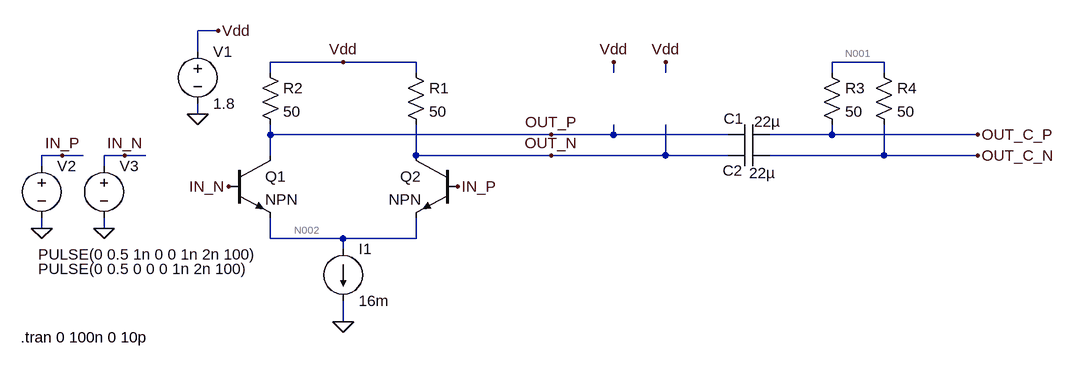
[diagram p0: schematic Draft1.asc]
Draft1.asc, the LTspice schematic file:
Version 4
SHEET 1 1184 680
WIRE -112 -32 -144 -32
WIRE -144 0 -144 -32
WIRE 80 16 -32 16
WIRE 192 16 80 16
WIRE 912 16 832 16
WIRE -32 32 -32 16
WIRE 192 32 192 16
WIRE 496 32 496 16
WIRE 576 32 576 16
WIRE 832 32 832 16
WIRE 912 32 912 16
WIRE -144 96 -144 80
WIRE -32 128 -32 112
WIRE 400 128 -32 128
WIRE 496 128 496 112
WIRE 496 128 400 128
WIRE 672 128 496 128
WIRE 832 128 832 112
WIRE 832 128 736 128
WIRE 1056 128 832 128
WIRE -352 160 -384 160
WIRE -320 160 -352 160
WIRE -256 160 -288 160
WIRE -224 160 -256 160
WIRE -32 160 -32 128
WIRE 192 160 192 112
WIRE 400 160 192 160
WIRE 576 160 576 112
WIRE 576 160 400 160
WIRE 672 160 576 160
WIRE 912 160 912 112
WIRE 912 160 736 160
WIRE 1056 160 912 160
WIRE -384 176 -384 160
WIRE -288 176 -288 160
WIRE -384 272 -384 256
WIRE -288 272 -288 256
WIRE -32 288 -32 256
WIRE 80 288 -32 288
WIRE 192 288 192 256
WIRE 192 288 80 288
WIRE 80 304 80 288
WIRE 80 416 80 384
FLAG 80 416 0
FLAG -144 96 0
FLAG -384 272 0
FLAG -288 272 0
FLAG -352 160 IN_P
FLAG -256 160 IN_N
FLAG -96 208 IN_N
FLAG 256 208 IN_P
FLAG 400 128 OUT_P
FLAG 400 160 OUT_N
FLAG -112 -32 Vdd
FLAG 80 16 Vdd
FLAG 496 16 Vdd
FLAG 576 16 Vdd
FLAG 1056 128 OUT_C_P
FLAG 1056 160 OUT_C_N
SYMBOL current 80 304 R0
WINDOW 123 0 0 Left 0
WINDOW 39 0 0 Left 0
SYMATTR InstName I1
SYMATTR Value 16m
SYMBOL res 176 16 R0
SYMATTR InstName R1
SYMATTR Value 50
SYMBOL res -48 16 R0
SYMATTR InstName R2
SYMATTR Value 50
SYMBOL voltage -144 -16 R0
WINDOW 123 0 0 Left 0
WINDOW 39 0 0 Left 0
SYMATTR InstName V1
SYMATTR Value 1.8
SYMBOL voltage -384 160 R0
WINDOW 3 -5 175 Left 2
WINDOW 123 0 0 Left 0
WINDOW 39 0 0 Left 0
SYMATTR Value PULSE(0 0.5 0 0 0 1n 2n 100)
SYMATTR InstName V2
SYMBOL voltage -288 160 R0
WINDOW 3 -101 152 Left 2
WINDOW 123 0 0 Left 0
WINDOW 39 0 0 Left 0
SYMATTR Value PULSE(0 0.5 1n 0 0 1n 2n 100)
SYMATTR InstName V3
SYMBOL npn -96 160 R0
SYMATTR InstName Q1
SYMBOL npn 256 160 M0
SYMATTR InstName Q2
SYMBOL cap 736 144 R90
WINDOW 0 55 57 VBottom 2
WINDOW 3 27 11 VTop 2
SYMATTR InstName C2
SYMATTR Value 22µ
SYMBOL cap 736 112 R90
WINDOW 0 7 55 VBottom 2
WINDOW 3 -20 3 VTop 2
SYMATTR InstName C1
SYMATTR Value 22µ
SYMBOL res 816 16 R0
SYMATTR InstName R3
SYMATTR Value 50
SYMBOL res 896 16 R0
SYMATTR InstName R4
SYMATTR Value 50
TEXT -416 440 Left 2 !.tran 0 100n 0 10p

The netlist it stands for:
* Draft1.asc
I1 N002 0 16m
R1 Vdd OUT_N 50
R2 Vdd OUT_P 50
V1 Vdd 0 1.8
V2 IN_P 0 PULSE(0 0.5 0 0 0 1n 2n 100)
V3 IN_N 0 PULSE(0 0.5 1n 0 0 1n 2n 100)
Q1 OUT_P IN_N N002 0 NPN
Q2 OUT_N IN_P N002 0 NPN
C2 OUT_C_N OUT_N 22µ
C1 OUT_C_P OUT_P 22µ
R3 N001 OUT_C_P 50
R4 N001 OUT_C_N 50
.model NPN NPN
.model PNP PNP
.lib standard.bjt
.tran 0 100n 0 10p
.backanno
.end

* Results of the author's LTspice run, read from the files saved beside the schematic
* Operating Point, zero values left out:
*   V(n002) = -827.8 mV
*   V(vdd) = 1.8 V
*   V(out_n) = 1.404 V
*   V(out_p) = 1.404 V
*   V(out_c_n) = 61.77 µV
*   V(out_c_p) = 61.77 µV
*   V(n001) = 61.77 µV
*   Ic(Q1) = 7.921 mA
*   Ib(Q1) = 79.21 µA
*   Ie(Q1) = -8 mA
*   Ic(Q2) = 7.921 mA
*   Ib(Q2) = 79.21 µA
*   Ie(Q2) = -8 mA
*   I(I1) = 16 mA
*   I(R1) = 7.921 mA
*   I(R2) = 7.921 mA
*   I(V1) = -15.84 mA
*   I(V2) = -79.21 µA
*   I(V3) = -79.21 µA
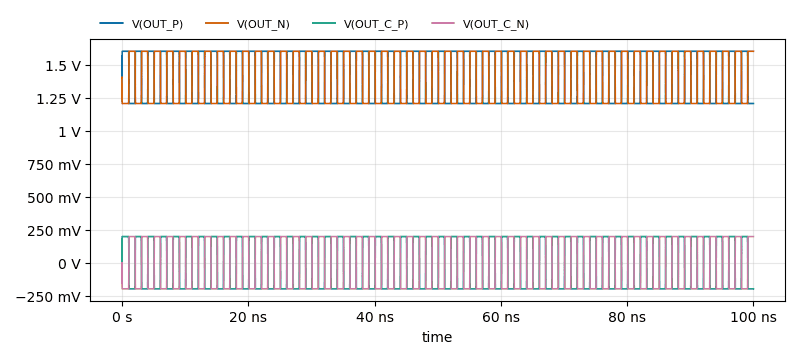
[diagram p1: Transient Analysis of Draft1.asc, plotted from the saved traces]
* Transient Analysis, 1 run:
*   V(OUT_P): min 1.206 V, max 1.602 V, average 1.404 V, rms 1.418 V, last 1.206 V
*   V(OUT_N): min 1.206 V, max 1.602 V, average 1.404 V, rms 1.417 V, last 1.602 V
*   V(OUT_C_P): min -198 mV, max 198.1 mV, average 440.5 µV, rms 195.6 mV, last -198 mV
*   V(OUT_C_N): min -198 mV, max 198.1 mV, average -316.9 µV, rms 195.6 mV, last 198.1 mV